# Altium schematic sheet Sheet1.SchDoc
size A; SheetNumber: 1; SheetTotal: 7
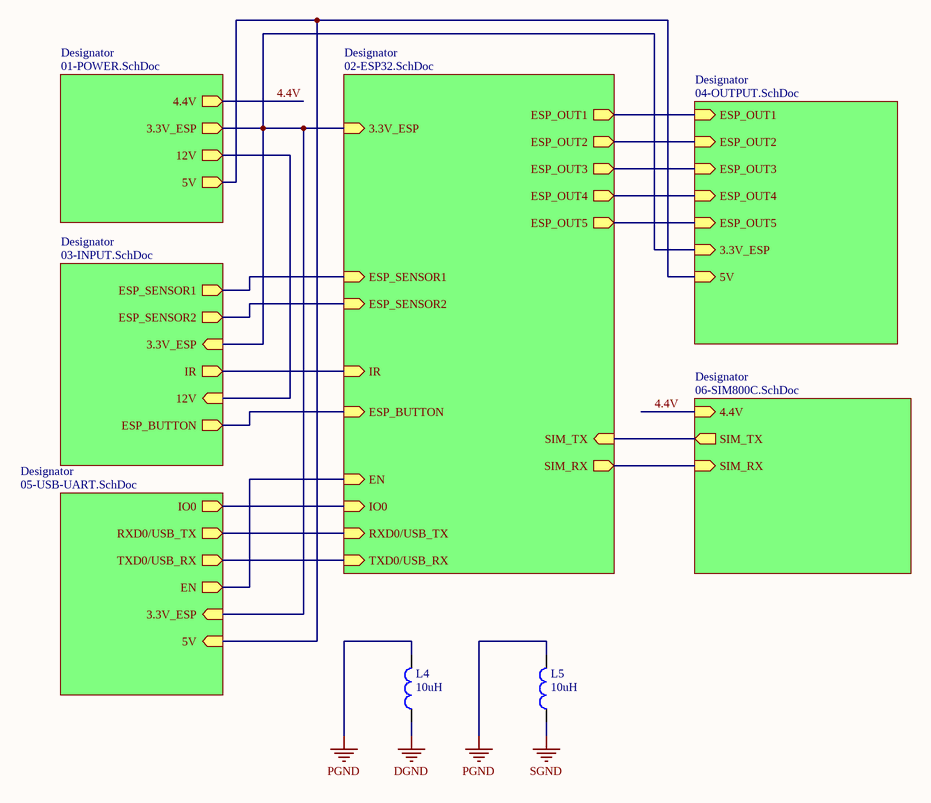
[diagram p0: Sheet1.SchDoc]

## Parts
L4  10uH  [L 2520mm]
L5  10uH  [L 2520mm]

## Sub-sheets
Designator = 03-INPUT.SchDoc: ESP_SENSOR1 (out), ESP_SENSOR2 (out), ESP_BUTTON (out), IR (out), 3.3V_ESP (in), 12V (in)
Designator = 02-ESP32.SchDoc: 3.3V_ESP (in), ESP_SENSOR1 (in), ESP_SENSOR2 (in), ESP_BUTTON (in), ESP_OUT1 (out), ESP_OUT2 (out), ESP_OUT3 (out), ESP_OUT4 (out), ESP_OUT5 (out), RXD0/USB_TX (in), TXD0/USB_RX (in), SIM_TX (in), SIM_RX (out), IR (in), IO0 (in), EN (in)
Designator = 01-POWER.SchDoc: 4.4V (out), 3.3V_ESP (out), 12V (out), 5V (out)
Designator = 04-OUTPUT.SchDoc: ESP_OUT1 (in), ESP_OUT2 (in), ESP_OUT3 (in), ESP_OUT4 (in), ESP_OUT5 (in), 3.3V_ESP (in), 5V (in)
Designator = 06-SIM800C.SchDoc: SIM_RX (in), SIM_TX (out), 4.4V (in)
Designator = 05-USB-UART.SchDoc: RXD0/USB_TX (out), TXD0/USB_RX (out), IO0 (out), EN (out), 3.3V_ESP (in), 5V (in)

## Nets
DGND: L4.1
PGND: L4.2 L5.2
SGND: L5.1
4.4V: sheet Designator/4.4V, sheet Designator/4.4V
(unnamed): sheet Designator/ESP_SENSOR1, sheet Designator/ESP_SENSOR1
(unnamed): sheet Designator/ESP_SENSOR2, sheet Designator/ESP_SENSOR2
(unnamed): sheet Designator/ESP_BUTTON, sheet Designator/ESP_BUTTON
(unnamed): sheet Designator/IR, sheet Designator/IR
(unnamed): sheet Designator/3.3V_ESP, sheet Designator/3.3V_ESP, sheet Designator/3.3V_ESP, sheet Designator/3.3V_ESP, sheet Designator/3.3V_ESP
(unnamed): sheet Designator/12V, sheet Designator/12V
(unnamed): sheet Designator/ESP_OUT1, sheet Designator/ESP_OUT1
(unnamed): sheet Designator/ESP_OUT2, sheet Designator/ESP_OUT2
(unnamed): sheet Designator/ESP_OUT3, sheet Designator/ESP_OUT3
(unnamed): sheet Designator/ESP_OUT4, sheet Designator/ESP_OUT4
(unnamed): sheet Designator/ESP_OUT5, sheet Designator/ESP_OUT5
(unnamed): sheet Designator/RXD0/USB_TX, sheet Designator/RXD0/USB_TX
(unnamed): sheet Designator/TXD0/USB_RX, sheet Designator/TXD0/USB_RX
(unnamed): sheet Designator/SIM_TX, sheet Designator/SIM_TX
(unnamed): sheet Designator/SIM_RX, sheet Designator/SIM_RX
(unnamed): sheet Designator/IO0, sheet Designator/IO0
(unnamed): sheet Designator/EN, sheet Designator/EN
(unnamed): sheet Designator/5V, sheet Designator/5V, sheet Designator/5V

## Library data of the parts
L4 L5 = L1: Inductor; Value: 150 mH